# Altium schematic sheet signal_proccessing.SchDoc
size A2; SheetNumber: 1; SheetTotal: 1
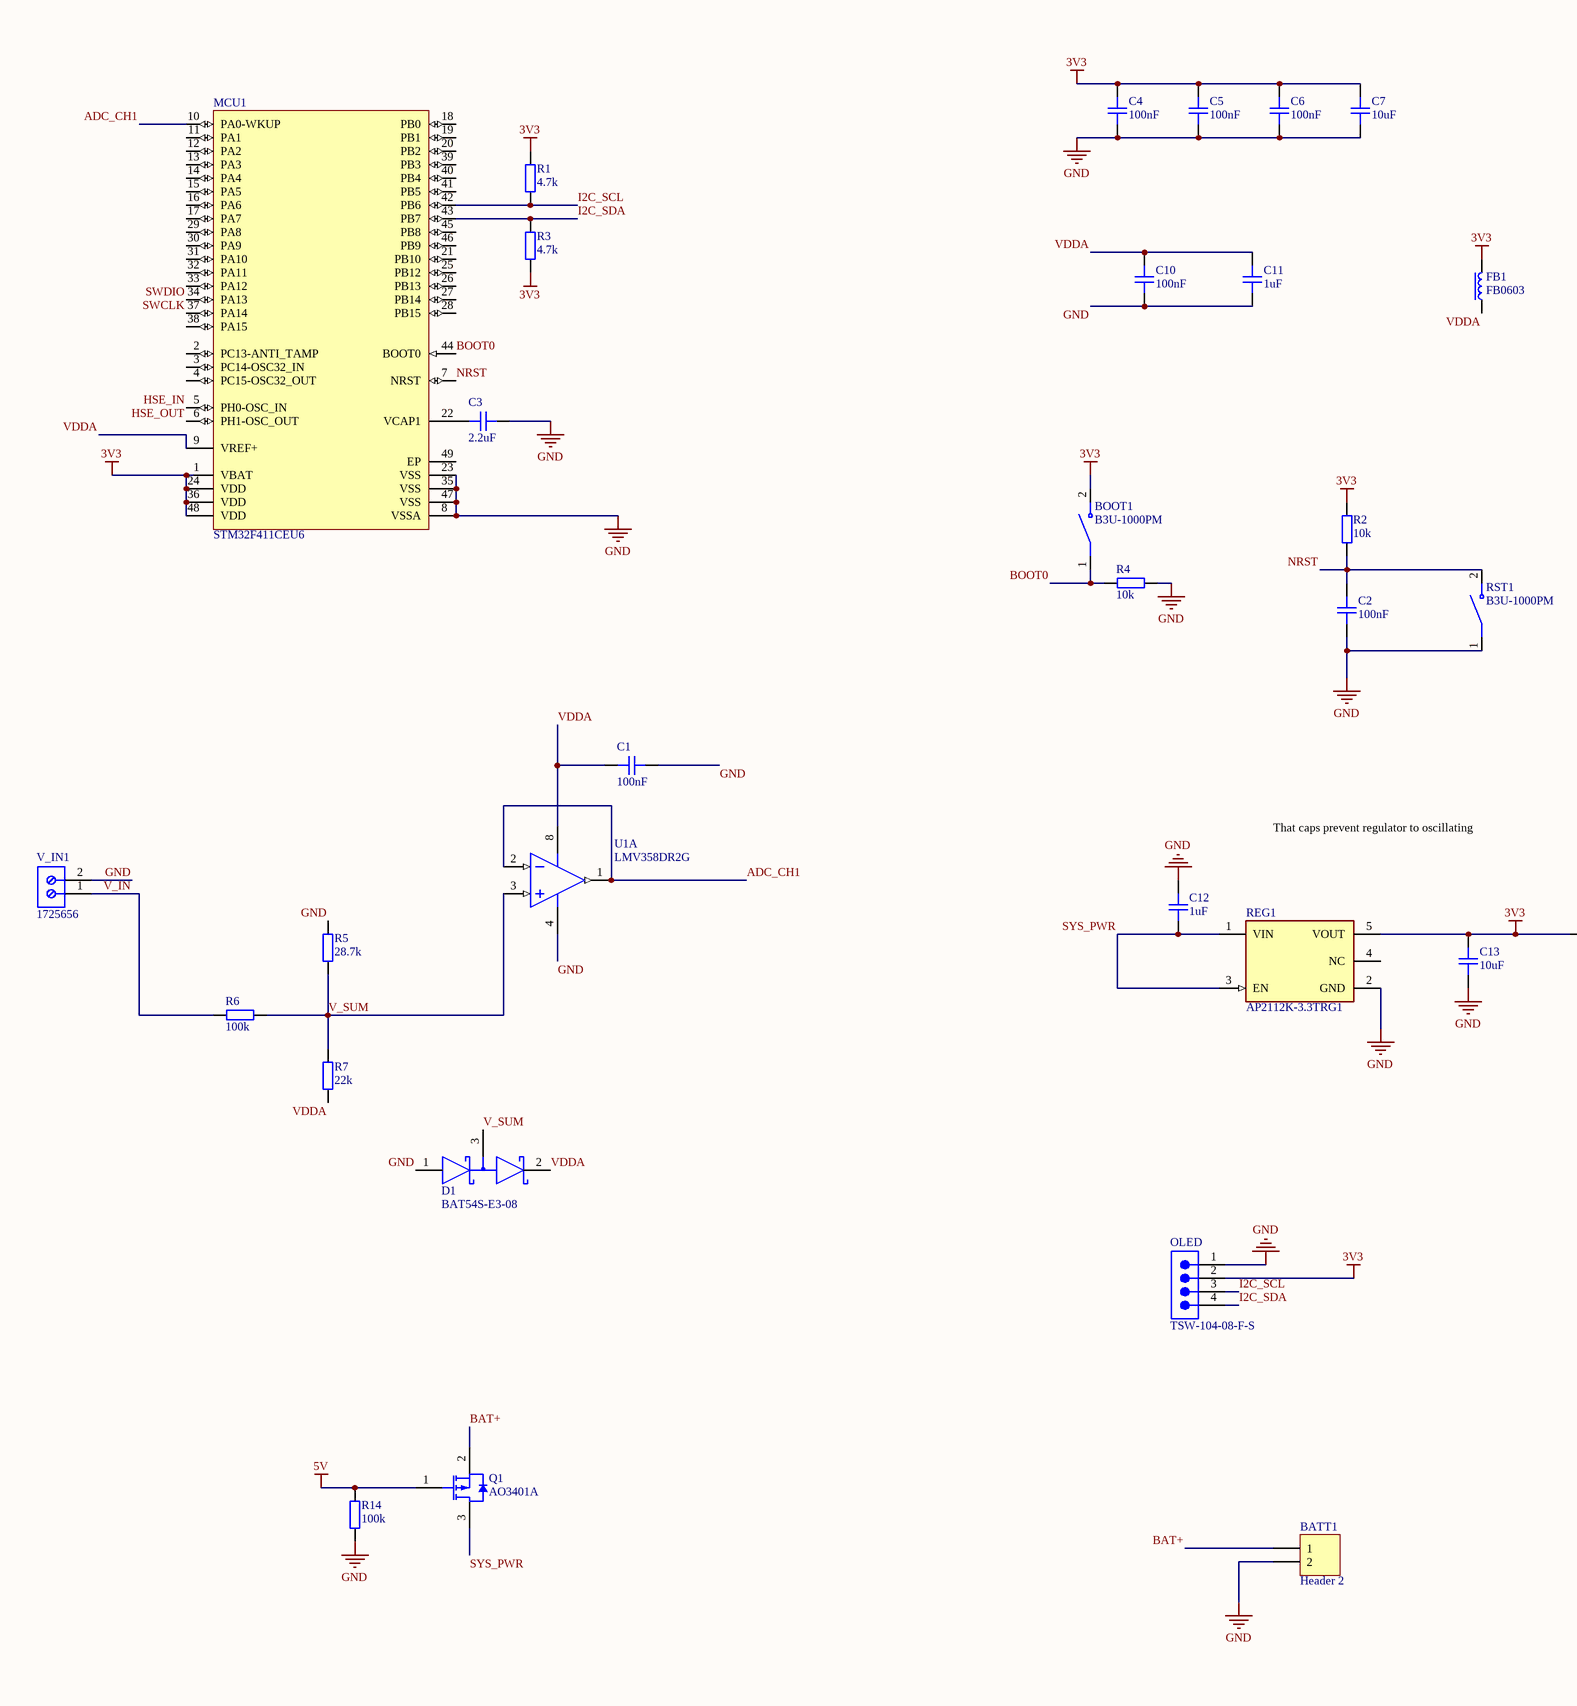
[diagram p0: signal_proccessing.SchDoc, left]
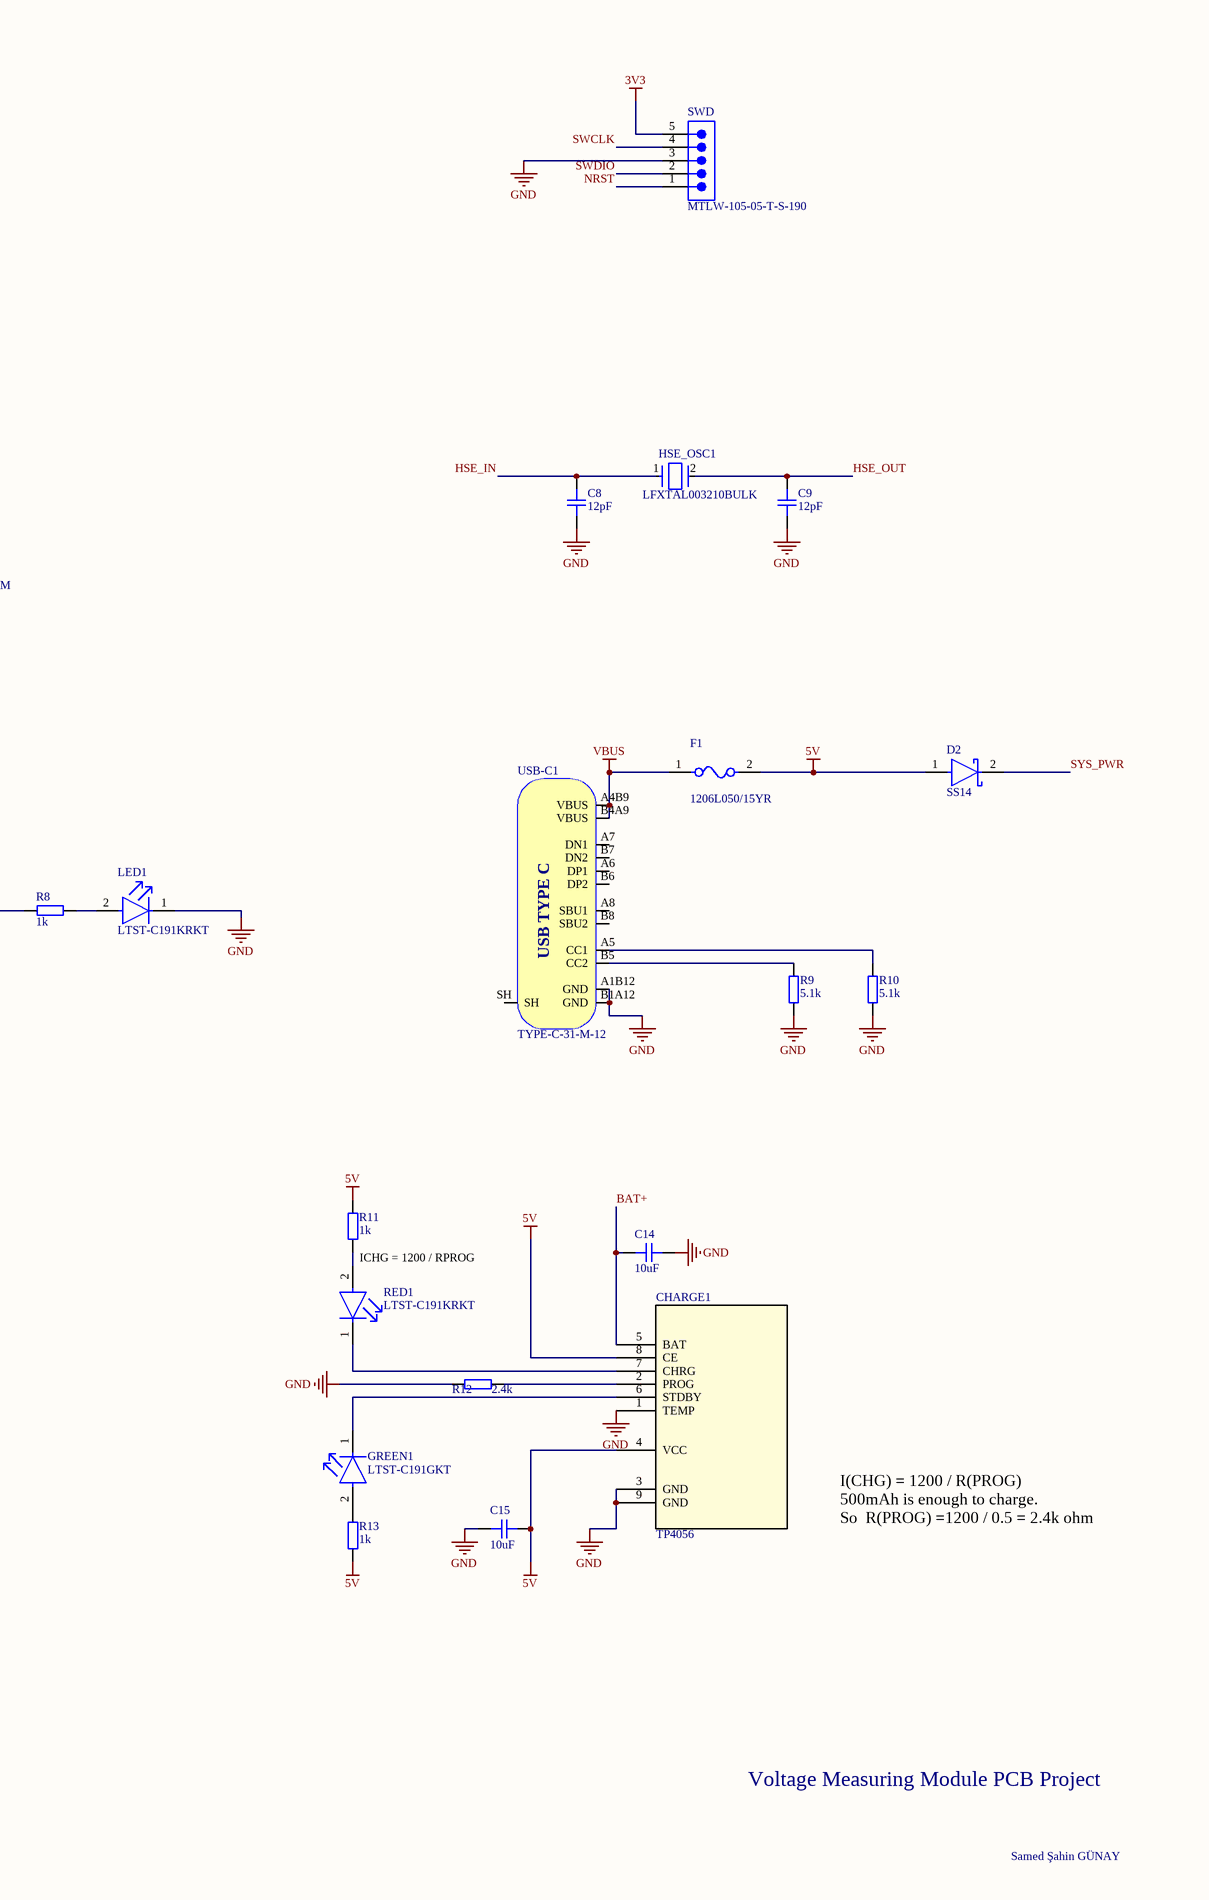
[diagram p1: signal_proccessing.SchDoc, right]

## Parts
BATT1  Header 2  [HDR1X2]
BOOT1  B3U-1000PM  [SW_B3U-1000PM]
C1  100nF  [CAP_0402]
C2  100nF  [CAP_0402]
C3  2.2uF  [CAP_0603]
C4  100nF  [CAP_0402]
C5  100nF  [CAP_0402]
C6  100nF  [CAP_0402]
C7  10uF  [CAP_0603]
C8  12pF  [CAP_0402]
C9  12pF  [CAP_0402]
C10  100nF  [CAP_0402]
C11  1uF  [CAP_0603]
C12  1uF  [CAP_0603]
C13  10uF  [CAP_0603]
C14  10uF  [CAP_0603]
C15  10uF  [CAP_0603]
CHARGE1  TP4056  [ESOP8_UMW]
D1  BAT54S-E3-08  [FP-6_541-5014_01-4-MFG]
D2  SS14  [FP-403AE-MFG]
F1  1206L050/15YR  [FP-1206L-MFG]
FB1  FB0603  [FB_0603]
GREEN1  LTST-C191GKT  [FP-LTST-C191GKT-MFG]
HSE_OSC1  LFXTAL003210BULK  [FP-LFXTAL003210BULK-MFG]
LED1  LTST-C191KRKT  [FP-LTST-C191KRKT-MFG]
MCU1  STM32F411CEU6  [STM-UFQFPN48_L]
OLED  TSW-104-08-F-S  [SMTC-TSW-104-08-X-S]
Q1  AO3401A  [AO-SOT-23-3L_V]
R1  4.7k  [RES_0603]
R2  10k  [RES_0603]
R3  4.7k  [RES_0603]
R4  10k  [RES_0603]
R5  28.7k  [RES_0603]
R6  100k  [RES_0603]
R7  22k  [RES_0603]
R8  1k  [RES_0603]
R9  5.1k  [RES_0603]
R10  5.1k  [RES_0603]
R11  1k  [RES_0603]
R12  2.4k  [RES_0603]
R13  1k  [RES_0603]
R14  100k  [RES_0603]
RED1  LTST-C191KRKT  [FP-LTST-C191KRKT-MFG]
REG1  AP2112K-3.3TRG1  [FP-SOT25-IPC_A]
RST1  B3U-1000PM  [SW_B3U-1000PM]
SWD  MTLW-105-05-T-S-190  [SMTC-MTLW-105-05-X-S-190]
U1  LMV358DR2G  [ONSC-SOIC-8-751-07_V]  (part A of 2)
USB-C1  TYPE-C-31-M-12  [TYPE-C-31-M-12]
V_IN1  1725656  [PHOE-1725656-2]

## Nets
3V3: BOOT1.2 C4.2 C5.2 C6.2 C7.2 C13.2 FB1.2 MCU1.1(VBAT) MCU1.24(VDD) MCU1.36(VDD) MCU1.48(VDD) OLED.2 R1.2 R2.2 R3.1 R8.1 REG1.5(VOUT) SWD.5
5V: C15.2 CHARGE1.4(VCC) CHARGE1.8(CE) D2.1(A) F1.2 Q1.1(GATE) R11.1 R13.2 R14.1
GND: BATT1.2 C1.1 C2.1 C3.1 C4.1 C5.1 C6.1 C7.1 C8.1 C9.1 C10.1 C11.1 C12.2 C13.1 C14.2 C15.1 CHARGE1.1(TEMP) CHARGE1.3(GND) CHARGE1.9(GND) D1.1 LED1.1(C) MCU1.8(VSSA) MCU1.23(VSS) MCU1.35(VSS) MCU1.47(VSS) OLED.1 R4.2 R5.1 R9.2 R10.2 R12.1 R14.2 REG1.2(GND) RST1.1 SWD.3 U1.4(V-) USB-C1.A1B12(GND) USB-C1.B1A12(GND) V_IN1.2
VBUS: F1.1 USB-C1.A4B9(VBUS) USB-C1.B4A9(VBUS)
ADC_CH1: MCU1.10(PA0-WKUP) U1.1(OUTA) U1.2(INA-)
BAT+: BATT1.1 C14.1 CHARGE1.5(BAT) Q1.2(SOURCE)
BOOT0: BOOT1.1 MCU1.44(BOOT0) R4.1
HSE_IN: C8.2 HSE_OSC1.1 MCU1.5(PH0-OSC_IN)
HSE_OUT: C9.2 HSE_OSC1.2 MCU1.6(PH1-OSC_OUT)
I2C_SCL: MCU1.42(PB6) OLED.3 R1.1
I2C_SDA: MCU1.43(PB7) OLED.4 R3.2
NRST: C2.2 MCU1.7(NRST) R2.1 RST1.2 SWD.1
SWCLK: MCU1.37(PA14) SWD.4
SWDIO: MCU1.34(PA13) SWD.2
SYS_PWR: C12.1 D2.2(C) Q1.3(DRAIN) REG1.1(VIN) REG1.3(EN)
V_IN: R6.2 V_IN1.1
V_SUM: D1.3 R5.2 R6.1 R7.1 U1.3(INA+)
VDDA: C1.2 C10.2 C11.2 D1.2 FB1.1 MCU1.9(VREF+) R7.2 U1.8(V+)
NetC3_2: C3.2 MCU1.22(VCAP1)
NetCHARGE1_2: CHARGE1.2(PROG) R12.2
NetCHARGE1_6: CHARGE1.6(STDBY) GREEN1.1(C)
NetCHARGE1_7: CHARGE1.7(CHRG) RED1.1(C)
NetGREEN1_2: GREEN1.2(A) R13.1
NetLED1_2: LED1.2(A) R8.2
NetR9_1: R9.1 USB-C1.B5(CC2)
NetR10_1: R10.1 USB-C1.A5(CC1)
NetR11_2: R11.2 RED1.2(A)

Not connected (* = marked no-connect by the designer): MCU1 2(PC13-ANTI_TAMP) 3(PC14-OSC32_IN) 4(PC15-OSC32_OUT) 11(PA1) 12(PA2) 13(PA3) 14(PA4) 15(PA5) 16(PA6) 17(PA7) 18(PB0) 19(PB1) 20(PB2) 21(PB10) 25(PB12) 26(PB13) 27(PB14) 28(PB15) 29(PA8) 30(PA9) 31(PA10) 32(PA11) 33(PA12) 38(PA15) 39(PB3) 40(PB4) 41(PB5) 45(PB8) 46(PB9) 49(EP); REG1 4(NC); USB-C1 A6(DP1) A7(DN1) A8(SBU1) B6(DP2) B7(DN2) B8(SBU2) SH

## Notes on the sheet
- That caps prevent regulator to oscillating
- (near R11) ICHG = 1200 / RPROG
- I(CHG) = 1200 / R(PROG)                                                                                         500mAh is enough to charge.                                                                                                    So  R(PROG) =1200 / 0.5 = 2.4k ohm
- Voltage Measuring Module PCB Project
- Samed Şahin GÜNAY
- (in symbol TYPE-C-31-M-12) USB TYPE C

## Library data of the parts
BATT1 = Header 2: Header, 2-Pin; LatestRevisionDate: 17-Jul-2002; LatestRevisionNote: Re-released for DXP Platform.; Publisher: Altium Limited
BOOT1 RST1 = B3U-1000PM: Top, w/o Boss 1k Reel | Omron Electronic Components B3U-1000PM; SnapEDA_Link: https://www.snapeda.com/parts/B3U-1000PM/Omron/view-part/?ref=snap; Package: Custom Package Omron; Value: *; MF: Omron; MP: B3U-1000PM; Check_prices: https://www.snapeda.com/parts/B3U-1000PM/Omron/view-part/?ref=eda
C1 C2 C4-C6 C8-C10 = CAP_0402: Capacitor SMD 0402; Manufacturer: *; Manufacturer Part Number: *; Distributor Link: *; LCSC: *; Rating: *; Dielectric: *
C3 C7 C11-C15 = CAP_0603: Capacitor SMD 0603; Manufacturer: *; Manufacturer Part Number: *; Distributor Link: *; LCSC: *; Rating: *; Dielectric: *
CHARGE1 = TP4056: Description; Manufacturer_Name: UMW(Youtai Semiconductor Co., Ltd.); Type: Power Management; Copyright: Copyright (C) 2025 Ultra Librarian. All rights reserved.; Manufacturer_Part_Number: TP4056; RefDes: RefDes
D1 = CMP-02539-000028-1: DIODE ARRAY SCHOTTKY 30V SOT23; Manufacturer: Vishay; Capacitance: 10pF; Forward Current: 200mA; Max Junction Temp: +125°C; Value: 10pF; Max Surge Forward Current: 600mA; Peak Reverse Current: 2uA; Temperature: -55°C to +125°C; Device Class L1: Discrete Semiconductors; Height: 1.15mm; ComponentLink2Description: Datasheet; Mouser Description: Schottky Diodes & Rectifiers 200mA 30 Volt; Max Repetitive Reverse Voltage: 30V; Manufacturer Part Number: BAT54S-E3-08; Package: 6.541-5014.01-4; Temperature Range High: +125°C; Digikey Description: DIODE ARRAY SCHOTTKY 30V SOT23; Device Class L2: Diodes; ComponentLink2URL: http://www.vishay.com/docs/85508/bat54.pdf; RoHS: TRUE; Octopart: https://octopart.com/bat54s-e3-08-vishay-29186616; Automotive: No; Lead Free: Yes; Category: Diode; Temperature Range Low: -55°C; Device Class L3: Schottky Diodes
D2 = CMP-2000-04943-2: DIODE SCHOTTKY 40V 1A SMA; Manufacturer: ON Semiconductor; Peak Reverse Current: 0.2mA; Max Junction Temp: +125°C; Standoff Height: 0.05mm; Max Surge Forward Current: 40A; Mouser Description: Schottky Diodes & Rectifiers SMA 40V 1.0A; RoHS: TRUE; Lead Free: Yes; Manufacturer Part Number: SS14; Device Class L3: Schottky Diodes; Category: Diode; Automotive: No; Digikey Description: DIODE SCHOTTKY 40V 1A SMA; ComponentLink2Description: Datasheet; Device Class L2: Diodes; Height: 2.5mm; Temperature Range High: +125°C; ComponentLink2URL: https://www.onsemi.com/pub/Collateral/SS19-D.PDF; Device Class L1: Discrete Semiconductors; Package: 403AE; Octopart: https://octopart.com/ss14-on+semiconductor-29205033; Max Repetitive Reverse Voltage: 40V; Temperature Range Low: -65°C; Forward Current: 1A; Temperature: -65°C to +125°C
F1 = CMP-08606-000030-1: PTC RESET FUSE 15V 500MA 1206; Manufacturer: Littelfuse Inc; Trip Time: 0.1s; Trip Current: 1A; Value: 0.15-0.75Ω; Hold Current: 0.5A; Current Rating: 100A; Device Class L2: PTC Resettable Fuses; Height: 0.75mm; Temperature Range High: +85°C; Automotive: No; Package: 1206L; Lead Free: Yes; Mouser Description: Resettable Fuses - PPTC 15V 1206 .500A POLYFUSE; Digikey Description: PTC RESET FUSE 15V 500MA 1206; Manufacturer Part Number: 1206L050/15YR; Voltage Rating: 15V; Temperature Range Low: -40°C; Device Class L3: unset; Device Class L1: Circuit Protection; ComponentLink2URL: https://www.littelfuse.com/~/media/electronics/datasheets/resettable_ptcs/littelfuse_ptc_1206l_datasheet.pdf.pdf; RoHS: TRUE; Ambient Temperature Range High: +85°C; Temperature: -40°C to +85°C; Resistance: 0.15-0.75Ω; Ambient Temperature Range Low: -40°C; Octopart: https://octopart.com/1206l050%2F15yr-littelfuse-673645; ComponentLink2Description: Datasheet; Category: Fuse
FB1 = FB_0603: Ferrite Bead SMD 0603; Manufacturer: *; Manufacturer Part Number: *; Distributor Link: *; LCSC: *
GREEN1 = CMP-22017-000029-1: LED GREEN CLEAR CHIP SMD; Power Dissipation: 100mW; Lens Color: Colorless; Number of Elements: 1; Dominant Wavelength: 569nm; Forward Voltage: 2.1V; Forward Current: 30mA; Test Current: 20mA; Viewing Angle: 130°; Wavelength: 565nm; Luminous Intensity: 12mcd; Reverse Voltage: 5V; Case/Package: 0603; Package Quantity: 1; Illumination Color: Green; Lens Style: Clear; Lens Transparency: Clear; Depth: 0.8mm; Power Rating: 100mW; Width: 0.8mm; Height: 0.55mm; Radiation Hardening: No; Case Code (Imperial): 0603; Number of Pins: 2; Length: 1.6mm; Case Code (Metric): 1608; Max Operating Temperature: 85°C; Color: Green; Packaging: Tape and Reel; Mount: Surface Mount; Min Operating Temperature: -55°C; Lead Free: Lead Free; Number of LEDs: 1
HSE_OSC1 = CMP-96504-000002-1: CRYSTAL 12.0MHZ 16PF SMD; Manufacturer: IQD Frequency Products; Frequency: 12MHz; Esr: 40Ω; Stability: 50ppm; Tolerance: 30ppm; Lead Free: Yes; Device Class L2: Crystals / Oscillators; Manufacturer Part Number: LFXTAL003210BULK; Height: 4.3mm; Temperature Range Low: -10°C; Category: Crys; Temperature: -10°C to +60°C; Series: HC49/4HSMX; Automotive: No; Temperature Range High: +60°C; Package: LFXTAL003210BULK; ComponentLink2URL: https://www.iqdfrequencyproducts.com/products/pn/LFXTAL003210Bulk.pdf; Device Class L1: Passive Components; Digikey Description: CRYSTAL 12.0MHZ 16PF SMD; Octopart: https://octopart.com/lfxtal003210bulk-iqd+frequency+products-20904063; RoHS: TRUE; Load Capacitance: 16pF; ComponentLink2Description: Datasheet; Device Class L3: Crystals
LED1 RED1 = CMP-2000-05199-2: NexarPartId: 549908; Illumination Color: Red; Lens Transparency: Clear; Luminous Intensity: 54mcd; Current: 2A; Forward Current: 20mA; Number of Elements: 1; Power Rating: 75mW; Lens Color: Colorless; Wavelength: 639nm; Viewing Angle: 130°; Voltage: 2V; Dominant Wavelength: 631nm; Reverse Voltage: 5V; Height: 550µm; Length: 1.6mm; Number of Pins: 2; Packaging: Tape and Reel; Mount: Surface Mount; Case Code (Metric): 1608; Radiation Hardening: No; Case Code (Imperial): 0603; Test Current: 20mA; Number of LEDs: 1; Schedule B: 8541402000, 8541402000; Lead Free: Lead Free; Power Dissipation: 75mW; RoHS: Compliant; Forward Voltage: 2V; Lens Style: Clear; Color: Red; Max Operating Temperature: 85°C; Depth: 800µm; Width: 800µm; Min Operating Temperature: -55°C; Case/Package: 0603
MCU1 = CMP-0243-00165-1: ARM Cortex-M4 32-bit MCU+FPU, 512 KB Flash, 128 KB RAM, 36 I/Os, 48-Pin UFQFPN, -40 to 85 degC, Tray; Operating Frequency(F) (Processor speed) (MHz): 100; FLASH Size (Prog) (kB): 512; Internal RAM Size (kB): 128; I/Os (High Current): 36; Supply Voltage(Vcc) min (V): 1.7; Package Reference: 48-Pin Ultra Thin Fine Pitch Quad Flat No-Lead, 7 x 7 x 0.6 mm Body, 0.5 mm Pitch, Exposed Pad; ComponentLink1Description: Manufacturer URL; ComponentLink1URL: http://www.st.com/; Packing: Tray; Package Description: UFQFPN48; Core: ARM Cortex-M4; ComponentLink2Description: Datasheet; ComponentLink2URL: http://www.st.com/st-web-ui/static/active/en/resource/technical/document/datasheet/DM00115249.pdf; DatasheetVersion: Rev. 6; Mounting Technology: Surface Mount
OLED = CMP-1024-00355-1: 0.025" SQ Post Header, Through-hole, Vertical, -55 to 125 degC, 2.54 mm Pitch, 4-Pin, Male, RoHS; Manufacturer: Samtec; Pitch: 2.54 mm; Temperature Range: -55 to 125 degC; ComponentLink3URL: http://www.samtec.com/documents/webfiles/cpdf/TSW-XXX-XX-XXX-X-XX-XXX-MKT.pdf; ComponentLink1Description: Manufacturer URL; PackageReference: TSW-104-08-X-S; DatasheetVersion: F-214; Mounting Technology: Through-hole; ComponentLink3Description: Package Specification; PartNumber: TSW-104-08-F-S; PackageVersion: DM, 8/1988; ComponentLink2Description: Datasheet; ComponentLink1URL: http://www.samtec.com; Orientation: Vertical; ComponentLink2URL: http://www.samtec.com/documents/webfiles/pdf/TSW_TH.PDF; RoHS: True; PackageDescription: .025[0.64] SQ. Post Terminal Strip Assembly
Q1 = CMP-2000-05778-1: P-Channel MOSFET, 30 V, 4 A, -55 to 150 degC, 3-Pin SOT-23-3L, RoHS, Tape and Reel; Manufacturer: Alpha and Omega; Output Power (Max): NotRequiredW; Power Dissipation: 1.4W; Rad Hardened: No; Drain Efficiency: NotRequired%; Drain-Source On-Volt: 30V; Noise Figure: NotRequireddB; Frequency (Max): NotRequiredMHz; Number of  Elements: 1; Gate-Source Voltage (Max): ?12V; Drain Current (Max): 4A; Channel Mode: Enhancement; Drain-Source On-Res: 0.044ohm; Type: PowerMOSFET; Polarity: P; Package URL: http://www.aosmd.com/res/packaging_information/SOT-23-3L.pdf; Datasheet URL: http://www.aosmd.com/res/data_sheets/AO3401A.pdf; Package Type: SOT-23; Package Description: 3-Pin Small Outline Transistor, Body 2.95 x 1.6 mm, Pitch 0.95 mm; Mounting: SurfaceMount; Manufacturer URL: http://www.aosmd.com/; Continuous Drain Current: 4A; Package Reference: SOT-23-3L; Mounting Technology: SurfaceMount; Operating Temperature Classification: Military; Power Gain: NotRequireddB; Datasheet Version: Rev. 3, 03/2011; Operating Temp Range: -55Cto150C; Pin Count: 3
R1-R14 = RES_0603: Resistor SMD 0603; Manufacturer: *; Manufacturer Part Number: *; Distributor Link: *; LCSC: *
REG1 = CMP-12756-000035-1: IC REG LINEAR 3.3V 600MA SOT25; Number of Regulators: 1; Output Type: Fixed; Polarity: Positive; Min Input Voltage: 2.5V; Max Input Voltage: 6V; Accuracy: 1.5%; Quiescent Current: 55uA; Dropout Voltage: 250mV; Min Operating Temperature: -40°C; Length: 3.1mm; Output Current: 600mA; Max Operating Temperature: 85°C; Package Quantity: 1; Output Voltage: 3.3V; Width: 1.7mm; Number of Outputs: 1; Packaging: Tape and Reel; Height: 1.3mm; Lead Free: Lead Free; Max Output Current: 600mA; Case/Package: SOT-23-5; Mount: Surface Mount; Number of Pins: 5
SWD = CMP-1024-00077-1: Low Profile .025" SQ Post Header, Through-hole, Vertical, -55 to 105 degC, 2.54 mm Pitch, 5-Pin, Male, RoHS; Manufacturer: Samtec; Pitch: 2.54 mm; RoHS: True; Temperature Range: -55 to 105 degC; Orientation: Vertical; ComponentLink1Description: Manufacturer URL; DatasheetVersion: F-214; ComponentLink3URL: http://www.samtec.com/documents/webfiles/cpdf/MTLW-1XX-XX-XX-X-XXX-XX-XX-MKT1.pdf; ComponentLink2URL: http://www.samtec.com/documents/webfiles/pdf/MTLW_TH.PDF; Mounting Technology: Through-hole; ComponentLink1URL: http://www.samtec.com; ComponentLink2Description: Datasheet; PartNumber: MTLW-105-05-T-S-190; ComponentLink3Description: Package Specification; PackageVersion: T, 6/1991; PackageReference: MTLW-105-05-X-S-190; PackageDescription: Low Profile Terminal Assembly
U1 = CMP-1310-00286-1: Dual Low-Voltage, Rail-to-Rail Operational Amplifier, 2.7 to 5.5 V, -40 to 85 degC, 8-Pin SOIC, Pb-Free, Tape and Reel; Manufacturer: On Semiconductor; VCC Min (V): 2.7; VCC Max (V): 5.5; GBW Typ (MHz): 1; ComponentLink2Description: Datasheet; ComponentLink1URL: http://www.onsemi.com/; RoHS: TRUE; Packing: Tape and Reel; PackageDescription: 8-Pin Small Outline Integrated Circuit, Body 4.9 x 3.9 mm, Pitch 1.27 mm; DatasheetVersion: Rev. 10; ComponentLink3URL: http://www.onsemi.com/pub_link/Collateral/751-07.PDF; Mounting Technology: Surface Mount; PackageReference: SOIC-8-751-07; PackageVersion: Rev. AK, 02/2011; ComponentLink2URL: http://www.onsemi.cn/pub_link/Collateral/LMV321-LMV358-LMV324-D.PDF; ComponentLink1Description: Manufacturer URL; PartNumber: LMV358DR2G; SR Typ (V/uS): 1; ComponentLink3Description: Package Specification
USB-C1 = TYPE-C-31-M-12: USB Type C Connector Horizontal SMT; Manufacturer: Koren Hroparts; Manufacturer Part Number: TYPE-C-31-M-12
V_IN1 = CMP-2000-05299-1: Male Header, Pitch 2.54 mm, 1 x 2 Position, Height 9 mm, Tail Length 3.5 mm; Manufacturer: Phoenix Contact; Number of contacts: 2; Content: 250pc(s); Pitch: 2.54mm; Industrial packaging: Yes; Colour: Green; Manufacturer part No.: 1725656; Type: MPT0,5/2-2,54; Datasheet URL: http://datasheet.octopart.com/1725656-Phoenix-Contact-datasheet-5302866.pdf; Manufacturer URL: http://www.phoenixcontact.com/; Datasheet Version: Apr-08